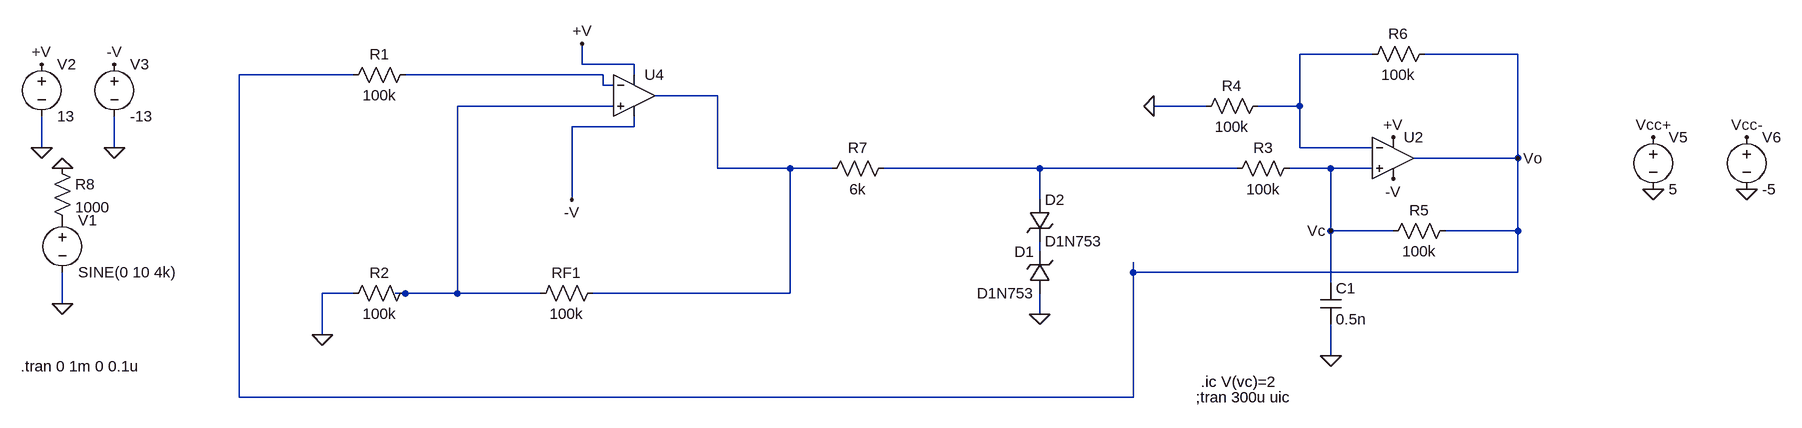
[diagram p0: schematic Ej3_Sedra.asc]
Ej3_Sedra.asc, the LTspice schematic file:
Version 4
SHEET 1 2184 704
WIRE 1552 160 1440 160
WIRE 1776 160 1632 160
WIRE 336 176 336 144
WIRE 416 176 336 176
WIRE -16 192 -192 192
WIRE 368 192 64 192
WIRE 416 192 416 176
WIRE 368 208 368 192
WIRE 384 208 368 208
WIRE 544 224 448 224
WIRE 384 240 144 240
WIRE 1296 240 1216 240
WIRE 1440 240 1440 160
WIRE 1440 240 1376 240
WIRE 416 272 416 256
WIRE 416 272 320 272
WIRE -496 304 -496 256
WIRE -384 304 -384 256
WIRE 1440 304 1440 240
WIRE 1552 304 1440 304
WIRE 1776 320 1776 160
WIRE 1776 320 1616 320
WIRE 544 336 544 224
WIRE 656 336 544 336
WIRE 720 336 656 336
WIRE 1040 336 800 336
WIRE 1344 336 1040 336
WIRE 1488 336 1424 336
WIRE 1552 336 1488 336
WIRE 320 384 320 272
WIRE 1040 384 1040 336
WIRE 1488 432 1488 336
WIRE 1584 432 1488 432
WIRE 1776 432 1776 320
WIRE 1776 432 1664 432
WIRE 1040 464 1040 448
WIRE 1184 496 1184 480
WIRE 1776 496 1776 432
WIRE 1776 496 1184 496
WIRE 1488 512 1488 432
WIRE -16 528 -64 528
WIRE 64 528 48 528
WIRE 144 528 144 240
WIRE 144 528 64 528
WIRE 272 528 144 528
WIRE 656 528 656 336
WIRE 656 528 352 528
WIRE -464 544 -464 496
WIRE 1040 560 1040 528
WIRE -64 592 -64 528
WIRE 1488 624 1488 576
WIRE -192 688 -192 192
WIRE 1184 688 1184 496
WIRE 1184 688 -192 688
FLAG -464 544 0
FLAG -64 592 0
FLAG 336 144 +V
FLAG 320 384 -V
FLAG -496 304 0
FLAG -384 304 0
FLAG -496 176 +V
FLAG -384 176 -V
FLAG 1984 368 0
FLAG 2128 368 0
FLAG 1984 288 Vcc+
FLAG 2128 288 Vcc-
FLAG 1216 240 0
FLAG 1488 624 0
FLAG 1776 320 Vo
FLAG 1488 432 Vc
FLAG 1040 560 0
FLAG -464 336 0
FLAG 1584 288 +V
FLAG 1584 352 -V
SYMBOL res 80 176 R90
WINDOW 0 0 56 VBottom 2
WINDOW 3 32 56 VTop 2
SYMATTR InstName R1
SYMATTR Value 100k
SYMBOL res 80 512 R90
WINDOW 0 0 56 VBottom 2
WINDOW 3 32 56 VTop 2
SYMATTR InstName R2
SYMATTR Value 100k
SYMBOL res 368 512 R90
WINDOW 0 0 56 VBottom 2
WINDOW 3 32 56 VTop 2
SYMATTR InstName RF1
SYMATTR Value 100k
SYMBOL voltage -464 400 R0
WINDOW 123 0 0 Left 2
WINDOW 39 0 0 Left 2
SYMATTR InstName V1
SYMATTR Value SINE(0 10 4k)
SYMBOL voltage -496 160 R0
WINDOW 123 0 0 Left 2
WINDOW 39 0 0 Left 2
SYMATTR InstName V2
SYMATTR Value 13
SYMBOL voltage -384 160 R0
WINDOW 123 0 0 Left 2
WINDOW 39 0 0 Left 2
SYMATTR InstName V3
SYMATTR Value -13
SYMBOL res 1440 320 R90
WINDOW 0 0 56 VBottom 2
WINDOW 3 32 56 VTop 2
SYMATTR InstName R3
SYMATTR Value 100k
SYMBOL voltage 1984 272 R0
SYMATTR InstName V5
SYMATTR Value 5
SYMBOL voltage 2128 272 R0
SYMATTR InstName V6
SYMATTR Value -5
SYMBOL res 1392 224 R90
WINDOW 0 0 56 VBottom 2
WINDOW 3 32 56 VTop 2
SYMATTR InstName R4
SYMATTR Value 100k
SYMBOL res 1680 416 R90
WINDOW 0 0 56 VBottom 2
WINDOW 3 32 56 VTop 2
SYMATTR InstName R5
SYMATTR Value 100k
SYMBOL cap 1472 512 R0
SYMATTR InstName C1
SYMATTR Value 0.5n
SYMBOL res 1648 144 R90
WINDOW 0 0 56 VBottom 2
WINDOW 3 32 56 VTop 2
SYMATTR InstName R6
SYMATTR Value 100k
SYMBOL res 816 320 R90
WINDOW 0 0 56 VBottom 2
WINDOW 3 32 56 VTop 2
SYMATTR InstName R7
SYMATTR Value 6k
SYMBOL res -480 320 R0
SYMATTR InstName R8
SYMATTR Value 1000
SYMBOL UniversalOpamp2 416 224 R0
SYMATTR InstName U4
SYMBOL UniversalOpamp2 1584 320 R0
SYMATTR InstName U2
SYMBOL zener 1024 384 R0
SYMATTR InstName D2
SYMATTR Value D1N753
SYMBOL zener 1056 528 R180
WINDOW 0 24 64 Left 2
WINDOW 3 24 0 Left 2
SYMATTR InstName D1
SYMATTR Value D1N753
TEXT -528 640 Left 2 !.tran 0 1m 0 0.1u
TEXT 1280 688 Left 2 !;tran 300u uic
TEXT 1288 664 Left 2 !.ic V(vc)=2

The netlist it stands for:
* Ej3_Sedra.asc
R1 N002 Vo 100k
R2 N004 0 100k
RF1 N003 N004 100k
V1 P001 0 SINE(0 10 4k)
V2 +V 0 13
V3 -V 0 -13
R3 Vc N005 100k
V5 Vcc+ 0 5
V6 Vcc- 0 -5
R4 N001 0 100k
R5 Vo Vc 100k
C1 Vc 0 0.5n
R6 Vo N001 100k
R7 N005 N003 6k
R8 0 P001 1000
XU4 N004 N002 +V -V N003 level.2 Avol=1Meg GBW=10Meg Slew=10Meg ilimit=25m rail=0 Vos=0 phimargin=45 en=0 enk=0 in=0 ink=0 Rin=500Meg  ; pins IN+ IN- V+ V- OUT
XU2 Vc N001 +V -V Vo level.2 Avol=1Meg GBW=10Meg Slew=10Meg ilimit=25m rail=0 Vos=0 phimargin=45 en=0 enk=0 in=0 ink=0 Rin=500Meg  ; pins IN+ IN- V+ V- OUT
D2 N005 N006 D1N753
D1 0 N006 D1N753
.model D D
.lib standard.dio
.tran 0 1m 0 0.1u
;tran 300u uic
.ic V(vc)=2
.lib UniversalOpamps2.sub
.backanno
.end